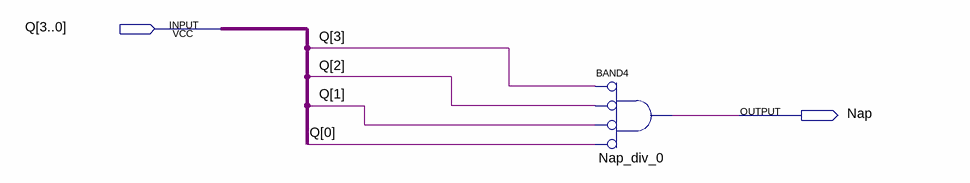
[diagram p0: schematic sheet]
// Quartus schematic Nap_Division.bdf as structural Verilog: 1 symbols, 2 pins
module Nap_Division (
  input  [3:0] Q,
  output Nap
);

  and Nap_div_0 (Nap, ~Q[3], ~Q[2], ~Q[1], ~Q[0]);  // BAND4
endmodule
